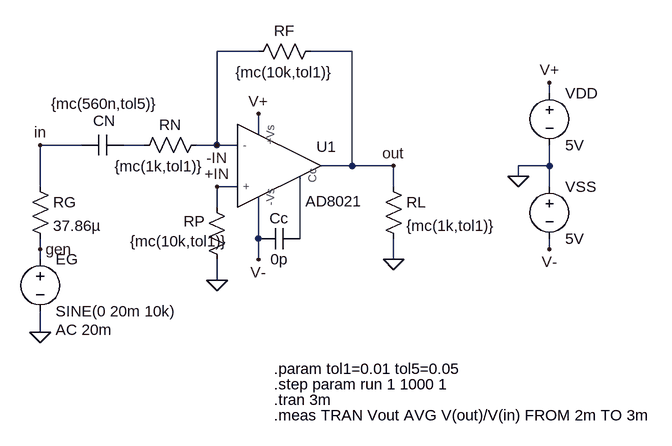
[diagram p0: schematic stage_2_mc.asc]
stage_2_mc.asc, the LTspice schematic file:
Version 4
SHEET 1 1116 792
WIRE 192 0 128 0
WIRE 336 0 272 0
WIRE 640 64 640 48
WIRE 192 128 192 96
WIRE -80 144 -144 144
WIRE 16 144 -16 144
WIRE 128 144 128 0
WIRE 128 144 96 144
WIRE 160 144 128 144
WIRE 336 176 336 0
WIRE 336 176 288 176
WIRE 400 176 336 176
WIRE 640 176 640 144
WIRE 640 176 592 176
WIRE 592 192 592 176
WIRE -144 208 -144 144
WIRE 160 208 128 208
WIRE 400 208 400 176
WIRE 640 208 640 176
WIRE 128 240 128 208
WIRE 192 288 192 224
WIRE 256 288 256 192
WIRE -144 304 -144 288
WIRE 640 304 640 288
WIRE -144 320 -144 304
WIRE 192 320 192 288
WIRE 400 320 400 288
WIRE 128 352 128 320
WIRE -144 432 -144 400
FLAG 592 192 0
FLAG 640 48 V+
FLAG 192 96 V+
FLAG 192 320 V-
FLAG 640 304 V-
FLAG -144 144 in
FLAG -144 432 0
FLAG 400 320 0
FLAG 400 176 out
FLAG 128 144 -IN
FLAG 128 208 +IN
FLAG 128 352 0
FLAG -144 304 gen
SYMBOL AutoGenerated\\AD8021 224 176 R0
WINDOW 0 73 -14 Bottom 2
WINDOW 3 84 39 Top 2
SYMATTR InstName U1
SYMBOL voltage 640 48 R0
SYMATTR InstName VDD
SYMATTR Value 5V
SYMBOL voltage 640 192 R0
SYMATTR InstName VSS
SYMATTR Value 5V
SYMBOL cap 256 272 R90
WINDOW 0 0 32 VBottom 2
WINDOW 3 32 32 VTop 2
SYMATTR InstName Cc
SYMATTR Value 0p
SYMBOL res 288 -16 R90
WINDOW 0 0 56 VBottom 2
WINDOW 3 32 56 VTop 2
SYMATTR InstName RF
SYMATTR Value {mc(10k,tol1)}
SYMBOL res 112 128 R90
WINDOW 0 0 56 VBottom 2
WINDOW 3 33 73 VTop 2
SYMATTR InstName RN
SYMATTR Value {mc(1k,tol1)}
SYMBOL voltage -144 304 R0
WINDOW 123 24 124 Left 2
WINDOW 39 0 0 Left 0
SYMATTR Value2 AC 20m
SYMATTR InstName EG
SYMATTR Value SINE(0 20m 10k)
SYMBOL cap -16 128 R90
WINDOW 0 -6 29 VBottom 2
WINDOW 3 -63 29 VTop 2
SYMATTR InstName CN
SYMATTR Value {mc(560n,tol5)}
SYMBOL res 112 224 R0
WINDOW 0 -35 37 Left 2
WINDOW 3 -118 68 Left 2
SYMATTR InstName RP
SYMATTR Value {mc(10k,tol1)}
SYMBOL res 384 192 R0
SYMATTR InstName RL
SYMATTR Value {mc(1k,tol1)}
SYMBOL res -160 192 R0
SYMATTR InstName RG
SYMATTR Value 37.86µ
TEXT 216 488 Left 2 !.param tol1=0.01 tol5=0.05
TEXT 216 512 Left 2 !.step param run 1 1000 1
TEXT 216 560 Left 2 !.meas TRAN Vout AVG V(out)/V(in) FROM 2m TO 3m
TEXT 216 536 Left 2 !.tran 3m

The netlist it stands for:
* stage_2_mc.asc
XU1 +IN -IN V+ V- out N002 AD8021  ; pins + - +Vs -Vs OUT Cc
VDD V+ 0 5V
VSS 0 V- 5V
Cc N002 V- 0p
RF out -IN {mc(10k,tol1)}
RN -IN N001 {mc(1k,tol1)}
V§EG gen 0 SINE(0 20m 10k) AC 20m
CN N001 in {mc(560n,tol5)}
RP +IN 0 {mc(10k,tol1)}
RL out 0 {mc(1k,tol1)}
RG in gen 37.86µ
.param tol1=0.01 tol5=0.05
.step param run 1 1000 1
.meas TRAN Vout AVG V(out)/V(in) FROM 2m TO 3m
.tran 3m
.lib Z:\home\pesho\data\Electronics\asht-kr\simulations\ad8021.cir
.backanno
.end